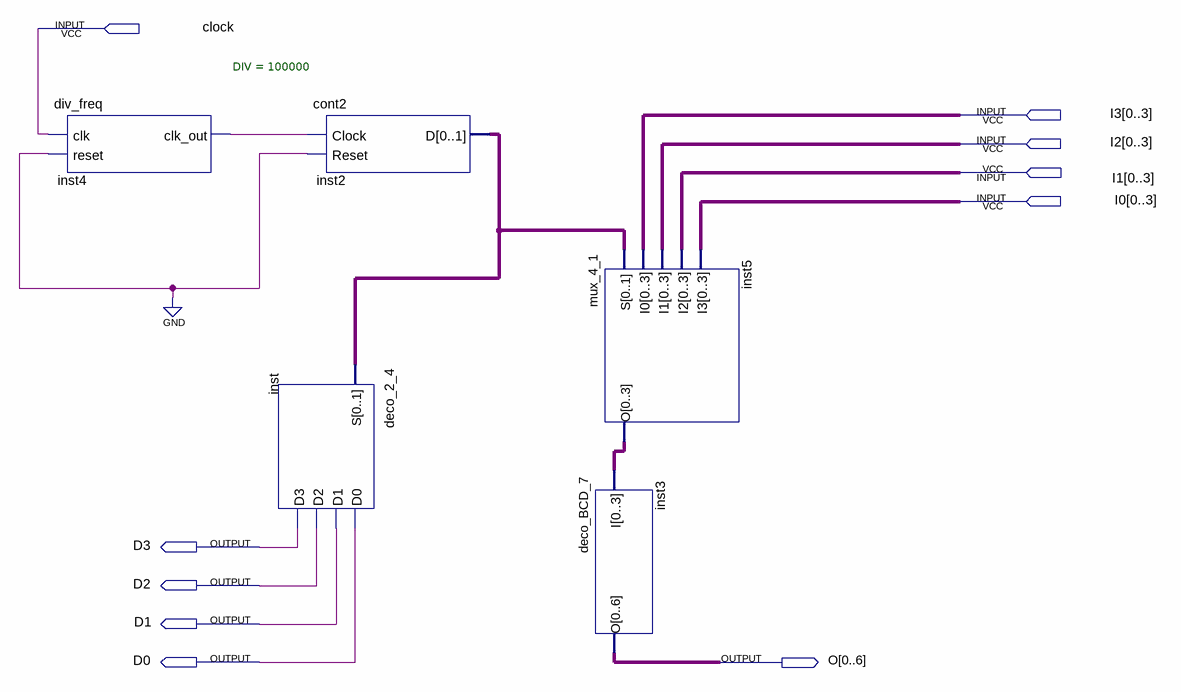
[diagram p0: schematic sheet]
// Quartus schematic P2.bdf as structural Verilog: 5 symbols, 10 pins
module P2 (
  input  clock,
  input  [0:3] I3,
  input  [0:3] I2,
  input  [0:3] I1,
  input  [0:3] I0,
  output D3,
  output D2,
  output D1,
  output D0,
  output [0:6] O
);

  wire inst4_clk_out;
  wire [1:0] inst2_d;
  wire [3:0] inst5_o;

  div_freq #(.DIV(100000)) inst4 (.clk(clock), .reset(1'b0), .clk_out(inst4_clk_out));
  cont2 inst2 (.Clock(inst4_clk_out), .Reset(1'b0), .D(inst2_d));
  deco_2_4 inst (.S(inst2_d), .D0(D0), .D1(D1), .D2(D2), .D3(D3));
  mux_4_1 inst5 (.S(inst2_d), .I0(I3), .I1(I2), .I2(I1), .I3(I0), .O(inst5_o));
  deco_BCD_7 inst3 (.I(inst5_o), .O(O));
endmodule
